# Altium schematic sheet HTBLEBMSALLCtrl_4G&AB_Sch_V0.1_260316.SchDoc
size A3; SheetNumber: 1; SheetTotal: 3
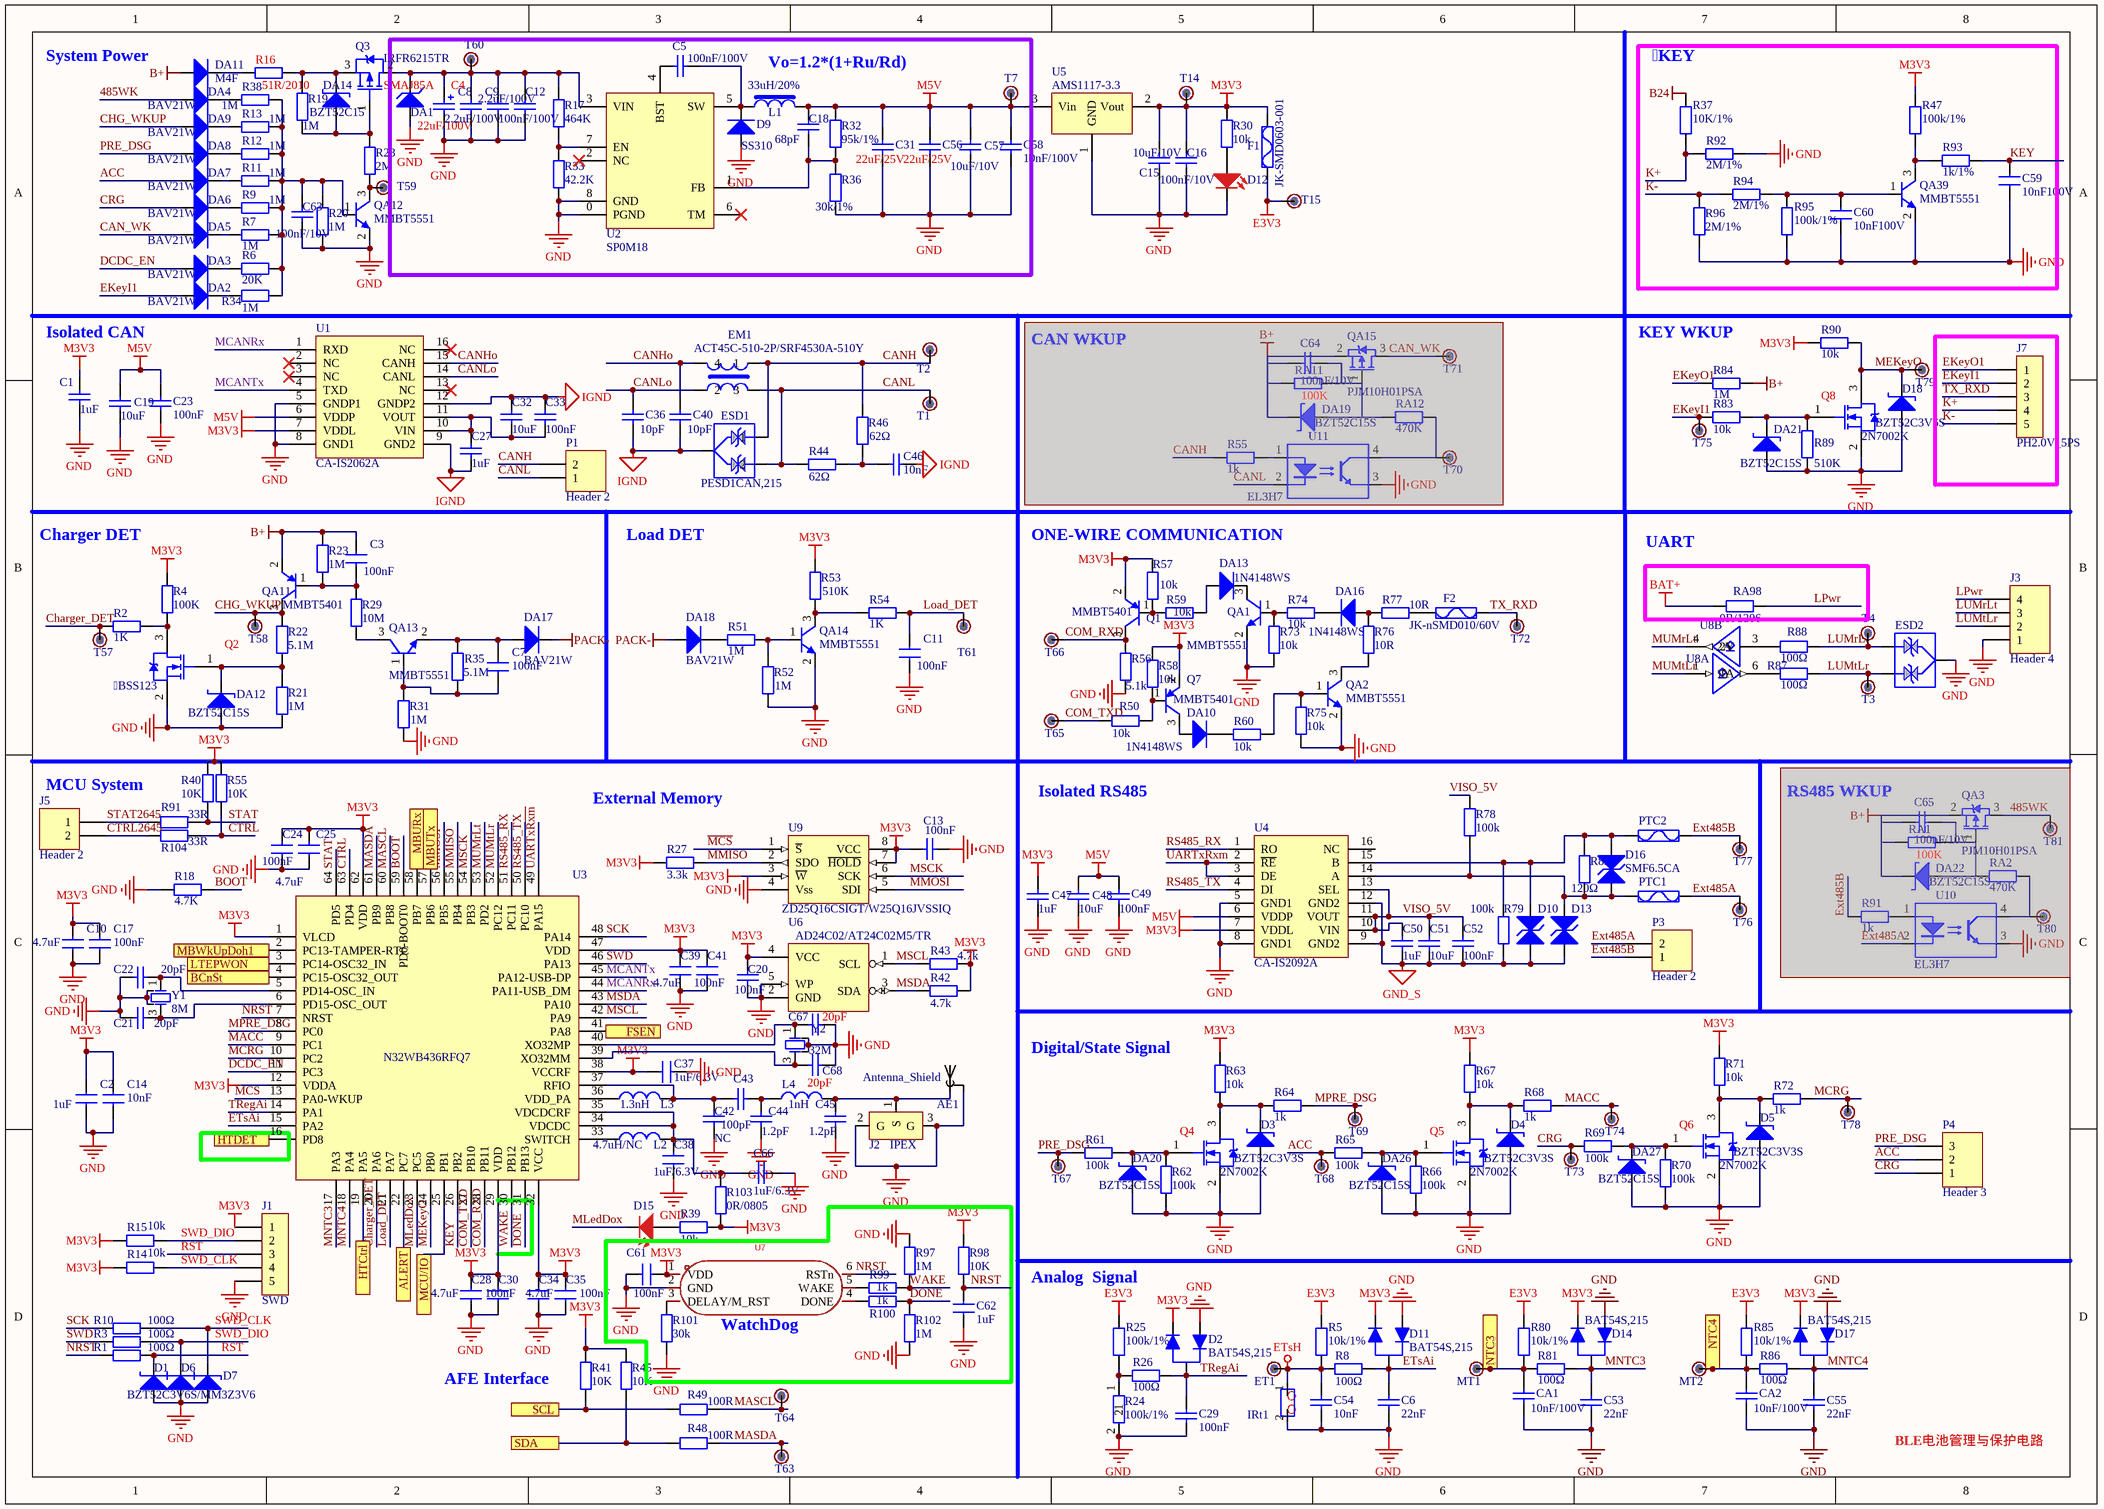
[diagram p0: HTBLEBMSALLCtrl_4G&AB_Sch_V0.1_260316.SchDoc]

## Parts
(Parts that share a designator on the sheet are numbered #1, #2 ... from top to bottom, then left to right.)
AE1  Antenna_Shield  [ANT-2]
C1  1uF  [C0603]
C2  1uF  [C0603]
C3  100nF  [C0603]
C4  value 22uF/100V  [SMD-EC6.3*6.3*10]  (hidden comment: Cap Pol2)
C5  100nF/100V  [C0603]
C6  22nF  [C0603]
C7  100nF  [C0603]
C8  2.2uF/100V  [C1206]
C9  2.2uF/100V  [C1206]
C10  4.7uF  [C0603]
C11  100nF  [C0603]
C12  100nF/100V  [C0603]
C13  100nF  [C0603]
C14  10nF  [C0603]
C15  10uF/10V  [C0603]
C16  100nF/10V  [C0603]
C17  100nF  [C0603]
C18  68pF  [C0603]
C19  10uF  [C0603]
C20  100nF  [C0603]
C21  20pF  [C0603]
C22  20pF  [C0603]
C23  100nF  [C0603]
C24  100nF  [C0603]
C25  4.7uF  [C0603]
C27  1uF  [C0603]
C28  4.7uF  [C0603]
C29  100nF  [C0603]
C30  100nF  [C0603]
C31  22uF/25V  [C0805]
C32  10uF  [C0603]
C33  100nF  [C0603]
C34  4.7uF  [C0603]
C35  100nF  [C0603]
C36  10pF  [C0603]
C37  1uF/6.3V  [0402C]
C38  1uF/6.3V  [0402C]
C39  4.7uF  [C0603]
C40  10pF  [C0603]
C41  100nF  [C0603]
C42  NC  [0402C]
C43  100pF  [0402C]
C44  1.2pF  [0402C]
C45  1.2pF  [0402C]
C46  10nF  [C0603]
C47  1uF  [C0603]
C48  10uF  [C0603]
C49  100nF  [C0603]
C50  1uF  [C0603]
C51  10uF  [C0603]
C52  100nF  [C0603]
C53  22nF  [C0603]
C54  10nF  [C0603]
C55  22nF  [C0603]
C56  22uF/25V  [C0805]
C57  10uF/10V  [C0603]
C58  10nF/100V  [C0603]
C59  10nF100V  [C0603]
C60  10nF100V  [C0603]
C61  100nF  [C0603]
C62  1uF  [C0603]
C63  100nF/10V  [C0603]
C64  100nF/10V  [C0603]  (masked out: inside a compile mask, not in the netlist)
C65  100nF/10V  [C0603]  (masked out: inside a compile mask, not in the netlist)
C66  1uF/6.3V  [0402C]
C67  20pF  [C0603]
C68  20pF  [C0603]
CA1  10nF/100V  [C0603]
CA2  10nF/100V  [C0603]
D1  BZT52C3V6S/MM3Z3V6  [SOD-323]  (value not drawn)
D2  BAT54S,215  [SOT23]
D3  BZT52C3V3S  [SOD-323]
D4  BZT52C3V3S  [SOD-323]
D5  BZT52C3V3S  [SOD-323]
D6  BZT52C3V6S/MM3Z3V6  [SOD-323]  (value not drawn)
D7  BZT52C3V6S/MM3Z3V6  [SOD-323]
D9  SS310  [SMA/DO-214AC]
D10  SMF6.5CA  [SOD-123]  (value not drawn)
D11  BAT54S,215  [SOT23]
D12  XL-1608SURC-06/XL-1608UBC-04  [LED0603R]  (value not drawn)
D13  SMF6.5CA  [SOD-123]  (value not drawn)
D14  BAT54S,215  [SOT23]
D15  XL-1608SURC-06/XL-1608UBC-04  [LED0603R]  (value not drawn)
D16  SMF6.5CA  [SOD-123]
D17  BAT54S,215  [SOT23]
D18  BZT52C3V6S  [SOD-323]
DA1  SMAJ85A  [SMA/DO-214AC]
DA2  BAV21W  [SOD-123]
DA3  BAV21W  [SOD-123]
DA4  BAV21W  [SOD-123]
DA5  BAV21W  [SOD-123]
DA6  BAV21W  [SOD-123]
DA7  BAV21W  [SOD-123]
DA8  BAV21W  [SOD-123]
DA9  BAV21W  [SOD-123]
DA10  1N4148WS  [SOD-323]
DA11  M4F  [SMAF]
DA12  BZT52C15S  [SOD-323]
DA13  1N4148WS  [SOD-323]
DA14  BZT52C15  [SOD-123]
DA16  1N4148WS  [SOD-323]
DA17  BAV21W  [SOD-123]
DA18  BAV21W  [SOD-123]
DA19  BZT52C15S  [SOD-323]  (masked out: inside a compile mask, not in the netlist)
DA20  BZT52C15S  [SOD-323]
DA21  BZT52C15S  [SOD-323]
DA22  BZT52C15S  [SOD-323]  (masked out: inside a compile mask, not in the netlist)
DA26  BZT52C15S  [SOD-323]
DA27  BZT52C15S  [SOD-323]
EM1  ACT45C-510-2P/SRF4530A-510Y  [WCM-4532]
ESD1  PESD1CAN,215  [SOT23]
ESD2  SET23A05L02-ES/SENC23T5V2UC  [SOT23]  (value not drawn)
ET1  ET1  [PT_STM]  (value not drawn)
F1  JK-SMD0603-001  [F0603]
F2  JK-nSMD010/60V  [F1206]
IRt1  NTC3950  [Pin HDR1X2/2.54mm-S]  (value not drawn)
J1  SWD  [Pin HDR1X5/2.54mm-S]
J2  IPEX  [IPEX-SMD_BWIPX-1-001E]
J3  Header 4  [PH2.0-WI-4P]
J5  Header 2  [PH2.0-WI-2P]
J7  PH2.0V_5PS  [PH2.0-WI-5P]
L1  33uH/20%  [IND-SMD_L7.3-W6.8]
L2  4.7uH/NC  [0603L-XG]
L3  1.3nH  [0402L]
L4  1nH  [0402L]
MT1  ET1  [PT_STM]  (value not drawn)
MT2  ET1  [PT_STM]  (value not drawn)
P1  Header 2  [PH2.0-WI-2P]
P3  Header 2  [PH2.0-WI-2P]
P4  Header 3  [PH2.0-WI-3P]
PTC1  JK-SMD0603-005  [F0603]  (value not drawn)
PTC2  JK-SMD0603-005  [F0603]  (value not drawn)
Q1  MMBT5401  [SOT23]
Q2  BSS123  [SOT23]
Q3  IRFR6215TR  [TO-252-3_L6.5-W5.8-P4.58-BL]
Q4  2N7002K  [SOT23]
Q5  2N7002K  [SOT23]
Q6  2N7002K  [SOT23]
Q7  MMBT5401  [SOT23]
Q8  2N7002K  [SOT23]
QA1  MMBT5551  [SOT23]
QA2  MMBT5551  [SOT23]
QA3  PJM10H01PSA  [SOT23]  (masked out: inside a compile mask, not in the netlist)
QA11  MMBT5401  [SOT23]
QA12  MMBT5551  [SOT23]
QA13  MMBT5551  [SOT23]
QA14  MMBT5551  [SOT23]
QA15  PJM10H01PSA  [SOT23]  (masked out: inside a compile mask, not in the netlist)
QA39  MMBT5551  [SOT23]
R1  100Ω  [0603]
R2  1K  [0603]
R3  100Ω  [0603]
R4  100K  [0603]
R5  10k/1%  [0603]
R6  20K  [0603]
R7  1M  [0603]
R8  100Ω  [0603]
R9  1M  [0603]
R10  100Ω  [0603]
R11  1M  [0603]
R12  1M  [0603]
R13  1M  [0603]
R14  10k  [0603]
R15  10k  [0603]
R16  51R/2010  [2010R]
R17  464K  [0603]
R18  4.7K  [0603]
R19  1M  [0603]
R20  1M  [0603]
R21  1M  [0603]
R22  5.1M  [0603]
R23  1M  [0603]
R24  100k/1%  [0603]
R25  100k/1%  [0603]
R26  100Ω  [0603]
R27  3.3k  [0603]
R28  2M  [0603]
R29  10M  [0603]
R30  10k  [0603]
R31  1M  [0603]
R32  95k/1%  [0603]
R33  42.2K  [0603]
R34  1M  [0603]
R35  5.1M  [0603]
R36  30k/1%  [0603]
R37  10K/1%  [0603]
R38  1M  [0603]
R39  10k  [0603]
R40  10K  [0603]
R41  10K  [0603]
R42  4.7k  [0603]
R43  4.7k  [0603]
R44  62Ω  [0603]
R45  10K  [0603]
R46  62Ω  [0603]
R47  100k/1%  [0603]
R48  100R  [0603]
R49  100R  [0603]
R50  10k  [0603]
R51  1M  [0603]
R52  1M  [0603]
R53  510K  [0603]
R54  1K  [0603]
R55#1  1k  [0603]  (masked out: inside a compile mask, not in the netlist)
R55#2  10K  [0603]
R56  5.1k  [0603]
R57  10k  [0603]
R58  10k  [0603]
R59  10k  [0603]
R60  10k  [0603]
R61  100k  [0603]
R62  100k  [0603]
R63  10k  [0603]
R64  1k  [0603]
R65  100k  [0603]
R66  100k  [0603]
R67  10k  [0603]
R68  1k  [0603]
R69  100k  [0603]
R70  100k  [0603]
R71  10k  [0603]
R72  1k  [0603]
R73  10k  [0603]
R74  10k  [0603]
R75  10k  [0603]
R76  10R  [0603]
R77  10R  [0603]
R78  100k  [0603]
R79  100k  [0603]
R80  10k/1%  [0603]
R81  100Ω  [0603]
R82  120Ω  [0603]
R83  10k  [0603]
R84  1M  [0603]
R85  10k/1%  [0603]
R86  100Ω  [0603]
R87  100Ω  [0603]
R88  100Ω  [0603]
R89  510K  [0603]
R90  10k  [0603]
R91#1  33R  [0603]
R91#2  1k  [0603]  (masked out: inside a compile mask, not in the netlist)
R92  2M/1%  [0603]
R93  1k/1%  [0603]
R94  2M/1%  [0603]
R95  100k/1%  [0603]
R96  2M/1%  [0603]
R97  1M  [0603]
R98  10K  [0603]
R99  1k  [0603]
R100  1k  [0603]
R101  30k  [0603]
R102  1M  [0603]
R103  0R/0805  [0603]
R104  33R  [0603]
RA1  100K  [0603]  (masked out: inside a compile mask, not in the netlist)
RA2  470K  [0603]  (masked out: inside a compile mask, not in the netlist)
RA11  100K  [0603]  (masked out: inside a compile mask, not in the netlist)
RA12  470K  [0603]  (masked out: inside a compile mask, not in the netlist)
RA98  0R/1206  [1206]
T1  CL  [PT_STM]  (value not drawn)
T2  CH  [PT_STM]  (value not drawn)
T3  Test  [PT_STM]  (value not drawn)
T4  Test  [PT_STM]  (value not drawn)
T7  M5  [PT_STM]  (value not drawn)
T14  M3  [PT_STM]  (value not drawn)
T15  E3  [PT_STM]  (value not drawn)
T57  M5  [PT_STM]  (value not drawn)
T58  M5  [PT_STM]  (value not drawn)
T59  M5  [PT_STM]  (value not drawn)
T60  M5  [PT_STM]  (value not drawn)
T61  M5  [PT_STM]  (value not drawn)
T63  M5  [PT_STM]  (value not drawn)
T64  M5  [PT_STM]  (value not drawn)
T65  M5  [PT_STM]  (value not drawn)
T66  M5  [PT_STM]  (value not drawn)
T67  M5  [PT_STM]  (value not drawn)
T68  M5  [PT_STM]  (value not drawn)
T69  M5  [PT_STM]  (value not drawn)
T70  M5  [PT_STM]  (value not drawn)  (masked out: inside a compile mask, not in the netlist)
T71  M5  [PT_STM]  (value not drawn)  (masked out: inside a compile mask, not in the netlist)
T72  M5  [PT_STM]  (value not drawn)
T73  M5  [PT_STM]  (value not drawn)
T74  M5  [PT_STM]  (value not drawn)
T75  M5  [PT_STM]  (value not drawn)
T76  M5  [PT_STM]  (value not drawn)
T77  M5  [PT_STM]  (value not drawn)
T78  M5  [PT_STM]  (value not drawn)
T79  M5  [PT_STM]  (value not drawn)
T80  M5  [PT_STM]  (value not drawn)  (masked out: inside a compile mask, not in the netlist)
T81  M5  [PT_STM]  (value not drawn)  (masked out: inside a compile mask, not in the netlist)
U1  CA-IS2062A  [LGA-16_L5.2-W4.7-P0.65-TL_CA-IS2062A-FRANK2]
U2  SP0M18  [ESOP-8]
U3  N32WB436RFQ7  [QFN64 8x8]
U4  CA-IS2092A  [LGA-16_L5.2-W4.7-P0.65-TL_CA-IS2062A-FRANK2]
U5  AMS1117-3.3  [SOT223]
U6  AD24C02/AT24C02M5/TR  [SOT23-5]
U7  TPL5010DDCR  [SOT23-6]  (value not drawn)
U8  AIP74LVC2G17GB236  [SOT23-6]  (value not drawn)  (parts A,B of 2)
U9  ZD25Q16CSIGT/W25Q16JVSSIQ  [SOIC-8_L5.3-W5.3-P1.27-LS8.0-BL]
U10  EL3H7  [SSOP-4_L2.7-W4.6-P1.27-LS7.0-TL]  (masked out: inside a compile mask, not in the netlist)
U11  EL3H7  [SSOP-4_L2.7-W4.6-P1.27-LS7.0-TL]  (masked out: inside a compile mask, not in the netlist)
Y1  8M  [SMD3225_4P]
Y2  32M  [SMD3225_4P]

## Blocks framed on the sheet
Vo=1.2*(1+Ru/Rd): C4 C5 C8 C9 C12 C18 C31 C56-C58 D9 DA1 L1 R17 R32 R33 R36 T7 T60 U2
KEY: C59 C60 QA39 R37 R47 R92-R96
UART: RA98
WatchDog: C61 C62 R97-R102 U7

## Ports
ALERT (see HTBLEBMSALLPro1_4G&AB_Sch_V0.1_260316[8C]), BCnSt (see HTBLEBMSALL4G&AB_Sch_V0.1_20260317[3A]), FSEN (see HTBLEBMSALLPro1_4G&AB_Sch_V0.1_260316[8D]), HTCtrl (see HTBLEBMSALLPro1_4G&AB_Sch_V0.1_260316[5D]), HTDET (see HTBLEBMSALLPro1_4G&AB_Sch_V0.1_260316[7D]), LTEPWON (see HTBLEBMSALL4G&AB_Sch_V0.1_20260317[1A]), MBURx (see HTBLEBMSALL4G&AB_Sch_V0.1_20260317[3B]), MBUTx (see HTBLEBMSALL4G&AB_Sch_V0.1_20260317[3B]), MBWkUpDoh1 (see HTBLEBMSALL4G&AB_Sch_V0.1_20260317[3A]), MCU/IO (see HTBLEBMSALLPro1_4G&AB_Sch_V0.1_260316[3A]), NTC3 (see HTBLEBMSALLPro1_4G&AB_Sch_V0.1_260316[3D]), NTC4 (see HTBLEBMSALLPro1_4G&AB_Sch_V0.1_260316[3D]), SCL (see HTBLEBMSALLPro1_4G&AB_Sch_V0.1_260316[4B]), SDA (see HTBLEBMSALLPro1_4G&AB_Sch_V0.1_260316[4B])

## Nets
B24: R37.1
B+: C3.1 DA11.1(A) QA11.2(E) R23.2 R84.2
BAT+: RA98.1
E3V3: F1.1 R5.1 R25.1 R80.1 R85.1 T15.1
ETsH: C54.2 ET1.1 IRt1.1 R5.2 R8.1
GND: AE1.2 C1.1 C2.2 C4.2 C6.1 C8.1 C9.1 C10.2 C11.2 C12.1 C13.1 C14.2 C15.1 C16.1 C17.2 C19.1 C20.1 C21.2 C22.2 C23.1 C24.2 C25.2 C28.2 C29.1 C30.2 C31.1 C34.2 C35.2 C37.2 C38.2 C39.2 C41.2 C42.1 C44.2 C45.2 C47.1 C48.1 C49.1 C53.1 C54.1 C55.1 C56.1 C57.1 C58.1 C59.1 C60.1 C61.1 C62.1 C63.1 C66.2 C67.2 C68.2 CA1.2 CA2.2 D1.1(A) D2.1(A) D3.1(A) D4.1(A) D5.1(A) D6.1(A) D7.1(A) D9.1(A) D11.1(A) D12.2(K) D14.1(A) D17.1(A) D18.1(A) DA1.1(A) DA12.1(A) DA20.1(A) DA21.1(A) DA26.1(A) DA27.1(A) ESD2.3 IRt1.2 J1.5 J2.2(G) J2.3(G) J3.1 Q2.2(S) Q4.2(S) Q5.2(S) Q6.2(S) Q8.2(S) QA1.2(E) QA2.2(E) QA12.2(E) QA14.2(E) QA39.2(E) R18.2 R20.2 R21.1 R24.2 R31.1 R33.1 R36.2 R52.1 R56.1 R62.1 R66.1 R70.1 R73.1 R75.1 R89.2 R92.2 R95.2 R96.1 R97.1 R101.2 R102.2 U1.5(GNDP1) U1.8(GND1) U2.0(PGND) U2.8(GND) U4.5(GND1) U4.8(GND1) U5.1(GND) U6.2(GND) U6.5(WP) U7.2(GND) U8.2(GND) U9.4(Vss) Y1.2(OSC2) Y1.4(OSC3) Y2.2(OSC2) Y2.4(OSC3)
GND_S: C50.1 C51.1 C52.1 D10.1(A) D13.1(A) R79.2 U4.9(GND2) U4.12(GND2)
IGND: C27.1 C32.2 C33.2 C36.1 C40.1 C46.1 ESD1.3 U1.9(GND2) U1.12(GNDP2)
M3V3: C1.2 C2.1 C10.1 C13.2 C14.1 C15.2 C16.2 C17.1 C20.2 C24.1 C25.1 C28.1 C30.1 C34.1 C35.1 C37.1 C39.1 C41.1 C47.2 C61.2 D2.2(K) D11.2(K) D14.2(K) D17.2(K) F1.2 J1.1 Q1.2(E) Q7.2(E) R4.2 R14.1 R15.1 R27.1 R30.2 R39.2 R40.1 R41.1 R42.1 R43.1 R45.1 R47.1 R53.2 R55#2.1 R57.2 R58.2 R63.2 R67.2 R71.2 R90.2 R98.1 R103.2 T14.1 U1.7(VDDL) U3.1(VLCD) U3.12(VDDA) U3.29(VDD) U3.32(VCC) U3.38(VCCRF) U3.47(VDD) U3.62(VDD) U4.7(VDDL) U5.2(Vout) U6.4(VCC) U7.1(VDD) U8.5(M3V3) U9.3(~{W}) U9.7(~{HOLD}) U9.8(VCC)
M5V: C18.1 C19.2 C23.2 C31.2 C48.2 C49.2 C56.2 C57.2 C58.2 L1.2 R32.1 T7.1 U1.6(VDDP) U4.6(VDDP) U5.3(Vin)
PACK-: DA17.2(K) DA18.1(A)
485WK: DA4.1(A)
ACC: DA7.1(A) P4.2 R65.1 T68.1
ALERT: U3.22(PC7) ; port ALERT
BCnSt: U3.4(PC15-OSC32_OUT) ; port BCnSt
BOOT: R18.1 U3.59(PD0-BOOT0)
CAN_WK: DA5.1(A)
CANH: EM1.1 ESD1.1 P1.2 R46.1 T2.1
CANHo: C40.2 EM1.4 U1.15(CANH)
CANL: EM1.3 ESD1.2 P1.1 R44.2 T1.1
CANLo: C36.2 EM1.2 U1.14(CANL)
Charger_DET: R2.1 T57.1 U3.20(PA6)
CHG_WKUP: DA9.1(A) QA11.3(C) R22.2 T58.1
COM_RXD: Q1.3(C) R56.2 T66.1 U3.28(PB11)
COM_TXD: R50.1 T65.1 U3.27(PB10)
CRG: DA6.1(A) P4.1 R69.1 T73.1
CTRL: R55#2.2 R104.1 U3.63(PD4)
CTRL2645: J5.2 R104.2
DCDC_EN: DA3.1(A) U3.11(PC3)
DONE: R100.2 R102.1 U3.31(PB13)
EKeyI1: DA2.1(A) J7.2 R83.1 T75.1
EKeyO1: J7.1 R84.1
ETsAi: C6.2 D11.3(C) R8.2 U3.15(PA2)
Ext485A: P3.2 PTC1.1 T76.1
Ext485B: P3.1 PTC2.1 T77.1
FSEN: U3.41(PA8) ; port FSEN
HTCtrl: U3.19(PA5) ; port HTCtrl
HTDET: U3.16(PD8) ; port HTDET
K+: J7.4 R37.2 R92.1
K-: J7.5 R94.1 R96.2
KEY: C59.2 R93.2 U3.26(PB2)
Load_DET: C11.1 R54.1 T61.1 U3.21(PA7)
LPwr: J3.4 RA98.2
LTEPWON: U3.3(PC14-OSC32_IN) ; port LTEPWON
LUMrLt: ESD2.1 J3.3 R88.1 T4.1
LUMtLr: ESD2.2 J3.2 R87.1 T3.1
~{MCS}: U3.13(PA0-WKUP) U9.1(~{S})
MACC: R68.1 T74.1 U3.9(PC1)
MASCL: R49.1 T64.1 U3.60(PB8)
MASDA: R48.1 T63.1 U3.61(PB9)
MBURx: U3.58(PB7) ; port MBURx
MBUTx: U3.57(PB6) ; port MBUTx
MBWkUpDoh1: U3.2(PC13-TAMPER-RTC) ; port MBWkUpDoh1
MCANRx: U1.1(RXD) U3.44(PA11-USB_DM)
MCANTx: U1.4(TXD) U3.45(PA12-USB-DP)
MCRG: R72.1 T78.1 U3.10(PC2)
MCU/IO: U3.25(PB1) ; port MCU/IO
MEKeyO: D18.2(K) Q8.3(D) R90.1 T79.1 U3.24(PB0)
MLedDox: D15.2(K) U3.23(PC5)
MMISO: R27.2 U3.55(PB4) U9.2(SDO)
MMOSI: U3.56(PB5) U9.5(SDI)
MNTC3: C53.2 D14.3(C) R81.2 U3.17(PA3)
MNTC4: C55.2 D17.3(C) R86.2 U3.18(PA4)
MPRE_DSG: R64.1 T69.1 U3.8(PC0)
MSCK: U3.54(PB3) U9.6(SCK)
MSCL: R43.2 U3.42(PA9) U6.1(SCL)
MSDA: R42.2 U3.43(PA10) U6.3(SDA)
MUMrLt: U3.53(PD2) U8.4(2Y)
MUMtLr: U3.52(PC12) U8.1(1A)
NRST: C62.2 R1.1 R98.2 U3.7(NRST) U7.6(RSTn)
NTC3: CA1.1 MT1.1 R80.2 R81.1 ; port NTC3
NTC4: CA2.1 MT2.1 R85.2 R86.1 ; port NTC4
PRE_DSG: DA8.1(A) P4.3 R61.1 T67.1
~{RST}: D1.2(K) J1.3 R1.2
RS485_RX: U3.51(PC11) U4.1(RO)
RS485_TX: U3.50(PC10) U4.4(DI)
SCK: R10.1 U3.48(PA14)
SCL: R41.2 R49.2 ; port SCL
SDA: R45.2 R48.2 ; port SDA
STAT: R40.2 R91#1.1 U3.64(PD5)
STAT2645: J5.1 R91#1.2
SWD: R3.1 U3.46(PA13)
SWD_CLK: D7.2(K) J1.4 R10.2 R14.2
SWD_DIO: D6.2(K) J1.2 R3.2 R15.2
TRegAi: C29.2 D2.3(C) R26.2 U3.14(PA1)
TX_RXD: F2.1 J7.3 T72.1
UARTx~{Rxm}: U3.49(PA15) U4.2(~{RE}) U4.3(DE)
VISO_5V: C50.2 C51.2 C52.2 R78.1 U4.10(VIN) U4.11(VOUT) U4.13(SEL)
WAKE: R97.2 R99.2 U3.30(PB12)
NetAE1_1: AE1.1 C45.1 J2.1(S) L4.2
NetC3_2: C3.2 QA11.1(B) R23.1 R29.2
NetC4_1: C4.1 C8.2 C9.2 C12.2 DA1.2(K) Q3.2(D) R17.2 T60.1 U2.3(VIN)
NetC5_1: C5.1 D9.2(K) L1.1 U2.5(SW)
NetC5_2: C5.2 U2.4(BST)
NetC7_1: C7.1 DA17.1(A) QA13.2(E) R35.2
NetC7_2: C7.2 QA13.1(B) R31.2 R35.1
NetC18_2: C18.2 R32.2 R36.1 U2.1(FB)
NetC21_1: C21.1 U3.6(PD15-OSC_OUT) Y1.3(OSC2)
NetC22_1: C22.1 U3.5(PD14-OSC_IN) Y1.1(OSC1)
NetC27_2: C27.2 C32.1 C33.1 U1.10(VIN) U1.11(VOUT)
NetC38_1: C38.1 C66.1 L2.1 R103.1 U3.34(VDCDC) U3.35(VDCDCRF)
NetC42_2: C42.2 C43.2 L3.1 U3.37(RFIO)
NetC43_1: C43.1 C44.1 L4.1
NetC46_2: C46.2 R44.1 R46.2
NetC60_2: C60.2 QA39.1(B) R94.2 R95.1
NetC63_2: C63.2 QA12.1(B) R6.1 R7.1 R9.1 R11.1 R12.1 R13.1 R20.1 R34.1 R38.1
NetC67_1: C67.1 U3.40(XO32MP) Y2.1(OSC1)
NetC68_1: C68.1 U3.39(XO32MM) Y2.3(OSC2)
NetD3_2: D3.2(K) Q4.3(D) R63.1 R64.2
NetD4_2: D4.2(K) Q5.3(D) R67.1 R68.2
NetD5_2: D5.2(K) Q6.3(D) R71.1 R72.2
NetD10_2: D10.2(K) D16.2(K) PTC2.2 R79.1 R82.1 U4.15(B)
NetD12_1: D12.1(A) R30.1
NetD13_2: D13.2(K) D16.1(A) PTC1.2 R78.2 R82.2 U4.14(A)
NetD15_1: D15.1(A) R39.1
NetDA2_2: DA2.2(K) R34.2
NetDA3_2: DA3.2(K) R6.2
NetDA4_2: DA4.2(K) R38.2
NetDA5_2: DA5.2(K) R7.2
NetDA6_2: DA6.2(K) R9.2
NetDA7_2: DA7.2(K) R11.2
NetDA8_2: DA8.2(K) R12.2
NetDA9_2: DA9.2(K) R13.2
NetDA10_1: DA10.1(A) Q7.3(C)
NetDA10_2: DA10.2(K) R60.1
NetDA11_2: DA11.2(K) R16.2
NetDA12_2: DA12.2(K) Q2.1(G) R21.2 R22.1
NetDA13_1: DA13.1(A) R59.2
NetDA13_2: DA13.2(K) QA1.3(C)
NetDA14_1: DA14.1(A) Q3.1(G) R19.1 R28.2
NetDA14_2: DA14.2(K) Q3.3(S) R16.1 R19.2
NetDA16_1: DA16.1(A) R76.2 R77.1
NetDA16_2: DA16.2(K) R74.1
NetDA18_2: DA18.2(K) R51.2
NetDA20_2: DA20.2(K) Q4.1(G) R61.2 R62.2
NetDA21_2: DA21.2(K) Q8.1(G) R83.2 R89.1
NetDA26_2: DA26.2(K) Q5.1(G) R65.2 R66.2
NetDA27_2: DA27.2(K) Q6.1(G) R69.2 R70.2
NetF2_2: F2.2 R77.2
NetL2_2: L2.2 U3.33(SWITCH)
NetL3_2: L3.2 U3.36(VDD_PA)
NetQ1_1: Q1.1(B) R57.1 R59.1
NetQ2_3: Q2.3(D) R2.2 R4.1
NetQ7_1: Q7.1(B) R50.2 R58.1
NetQA1_1: QA1.1(B) R73.2 R74.2
NetQA2_1: QA2.1(B) R60.2 R75.2
NetQA2_3: QA2.3(C) R76.1
NetQA12_3: QA12.3(C) R28.1 T59.1
NetQA13_3: QA13.3(C) R29.1
NetQA14_1: QA14.1(B) R51.1 R52.2
NetQA14_3: QA14.3(C) R53.1 R54.2
NetQA39_3: QA39.3(C) R47.2 R93.1
NetR17_1: R17.1 R33.2 U2.7(EN)
NetR24_1: R24.1 R25.2 R26.1
NetR87_2: R87.2 U8.6(1Y)
NetR88_2: R88.2 U8.3(2A)
NetR99_1: R99.1 U7.5(WAKE)
NetR100_1: R100.1 U7.4(DONE)
NetR101_1: R101.1 U7.3(DELAY/M_RST)

Not connected (* = marked no-connect by the designer): U1 2(NC)* 3(NC)* 13(NC)* 16(NC)*; U2 2(NC)* 6(TM)*; U4 16(NC)

## Notes on the sheet
- System Power
- Isolated CAN
- CAN WKUP
- (near R84) KEY WKUP
- Charger DET
- Load DET
- ONE-WIRE COMMUNICATION
- MCU System
- External Memory
- Isolated RS485
- RS485 WKUP
- (near R63) Digital/State Signal
- Analog  Signal
- (near R41) AFE Interface
- BLE电池管理与保护电路

## Library data of the parts
C1 C5 C6 C8 C9 C12 C13 C15 C16 C18-C23 C27 C29 C31-C33 C36 C40 C42-C58 C63-C68 CA1 CA2 = Cap: Capacitor
  C36 C40: value: 10pF
  C46: value: 10nF
C2 C3 C7 C10 C11 C14 C17 C24 C25 C28 C30 C34 C35 C37-C39 C41 C59-C62 = CAP: Capacitor
C4 = Cap Pol2: Polarized Capacitor (Axial); Published: 8-Jun-2000; LatestRevisionDate: 17-Jul-2002; LatestRevisionNote: Re-released for DXP Platform.; PackageReference: POLAR0.8; Publisher: Altium Limited; PackageDescription: Polarized Capacitor; 2 Leads
D1 D3-D7 D18 DA12 DA14 DA19-DA22 DA26 DA27 = D Zener: Zener Diode
D2 D11 D14 D17 = BAV199: DUAL SURFACE MOUNT LOW LEAKAGE DIODE; value: BAT54S-7-F; value1: BAT54S,215
D9 DA2-DA11 DA13 DA16-DA18 = Diode
D10 D13 D16 = D TVS: TVS Diode, bidirectional
D12 D15 = LEDR: Red LED
DA1 = Diode TVS: Uniderection TVS Diode
EM1 = ACT45B: EMC Components; Value: ACT45C-510-2P/SRF4530A-510Y
ESD1 ESD2 = PESD1CAN: CAN bus ESD protection diode in SOT23
  ESD1: value: PESD1CAN,215
  ESD2: value: SET23A05L02-ES/SENC23T5V2UC
ET1 MT1 MT2 T1-T4 T7 T14 T15 T57-T61 T63-T81 = TESTPOINT1
F1 F2 PTC1 PTC2 = Fuse: Published: 8-Jun-2000; LatestRevisionDate: 17-Jul-2002; LatestRevisionNote: Re-released for DXP Platform.; PackageReference: PIN-W2/E2.8; Publisher: Altium Limited
IRt1 = CON2-1: 2Pin
J1 = CON5: 5Pin
J2 = IPEX: NANO SIM 6Pin
J3 = Header 4: Header, 4-Pin; LatestRevisionDate: 17-Jul-2002; LatestRevisionNote: Re-released for DXP Platform.; Publisher: Altium Limited
J5 P1 P3 = Header 2: Header, 2-Pin; LatestRevisionDate: 17-Jul-2002; LatestRevisionNote: Re-released for DXP Platform.; Publisher: Altium Limited
J7 = Header 5: 5P接插件; 封装库来自淘宝卖家 ID：黄晶宝石: 最新版本发布https://item.taobao.com/item.htm?id=566775463719
L1 = Inductor2: SMD  6.6*7.0*2.8
L2-L4 = Inductor3: Inductor Iron
P4 = Header 3: Header, 3-Pin; LatestRevisionDate: 17-Jul-2002; LatestRevisionNote: Re-released for DXP Platform.; Publisher: Altium Limited
Q1 Q7 = 2N3906: PNP General Purpose Amplifier; Published: 8-Jun-2000; LatestRevisionDate: 15-Jan-2003; LatestRevisionNote: PCB Footprint 'BCY-W3/D4.7' replaced; DatasheetVersion: 1997; PackageVersion: Sep-1998; PackageReference: TO-92A; Publisher: Altium Limited; PackageDescription: TO, Flat Index; 3 In-Line, Axial Leads; Body Dia. 4.5mm; Leads 0.51 x 0.48 mm (max); ComponentLink1Description: Manufacturer Link; ComponentLink1URL: http://www.fairchildsemi.com/; ComponentLink2Description: Datasheet; ComponentLink2URL: http://www.fairchildsemi.com/ds/2N%2F2N3906.pdf
Q2 Q4-Q6 Q8 = NMOS-2: N-Channel Power MOSFET; Note: Pin 2 is electrically connected to pin 4.; Published: 8-Jun-2000; LatestRevisionDate: 17-Jul-2002; LatestRevisionNote: Re-released for DXP Platform.; DatasheetVersion: PD-9.814; PackageVersion: Feb-1997; PackageReference: TO-220AB; Publisher: Altium Limited; PackageDescription: TO, Thru-Hole, Vertical, Heatsink Mounted; 3 In-Line Leads; Pitch 2.54 mm; ComponentLink1Description: Manufacturer Link; ComponentLink1URL: http://www.irf.com/
Q3 = PMOS-2: P-Channel Power MOSFET; Note: Pin 4 not drawn and electrically connected to Pin 2.; Published: 8-Jun-2000; LatestRevisionDate: 17-Jul-2002; LatestRevisionNote: Re-released for DXP Platform.; DatasheetVersion: PD-9.390D; PackageVersion: Feb-1997; PackageReference: TO-220AB; Publisher: Altium Limited; PackageDescription: TO, Thru-Hole, Vertical, Heatsink Mounted; 3 In-Line Leads; Pitch 2.54 mm; ComponentLink1Description: Manufacturer Link; ComponentLink1URL: http://www.irf.com/
QA1 QA2 QA12-QA14 QA39 = S8050LT1: NPN Transistor
QA3 QA15 = IRLML6402: HEXFET PMOSFET
QA11 = S8550LT1: PNP Transistor
R1-R54 R55#1 R55#2 R56-R90 R91#1 R91#2 R92-R104 RA1 RA2 RA11 RA12 RA98 = Res2: Resistor
  R27: Value: 3.3k
  R44 R46: Value: 62Ω
  R82: Value: 120Ω
U2 = SP0M18: 100V 2A DCDC
U6 = AT24C0xM5/TR: I2C-Compatible (2-wire) Serial EEPROM
U7 = TPL5010DDCR: Manufacturer: TI(德州仪器); Add into BOM: yes; Voltage - Supply: 1.8V~5.5V; Current - Supply: 35nA; Symbol: TPL5010DDCR; Device: TPL5010DDCR; LCSC Part Name: TPL5010DDCR; Supplier Part: C473912; Manufacturer Part: TPL5010DDCR; Supplier Footprint: SOT-23-Thin-6; JLCPCB Part Class: Extended Part; Datasheet: https://www.ti.com/cn/lit/gpn/tpl5010; Supplier: LCSC; Convert to PCB: yes; Operating Temperature: -40℃~+105℃
U8 = 74LVC2G17: 2bit Buffers Schmitt Trigger
U9 = M95128/256: EEPROM,Serial SPI; value: ZD25Q16CSIGT/W25Q16JVSSIQ
U10 U11 = TLP521-1
Y1 Y2 = XTAL3: Crystal Oscillator